# Altium schematic sheet 202011AWSNP03.SchDoc
size A4
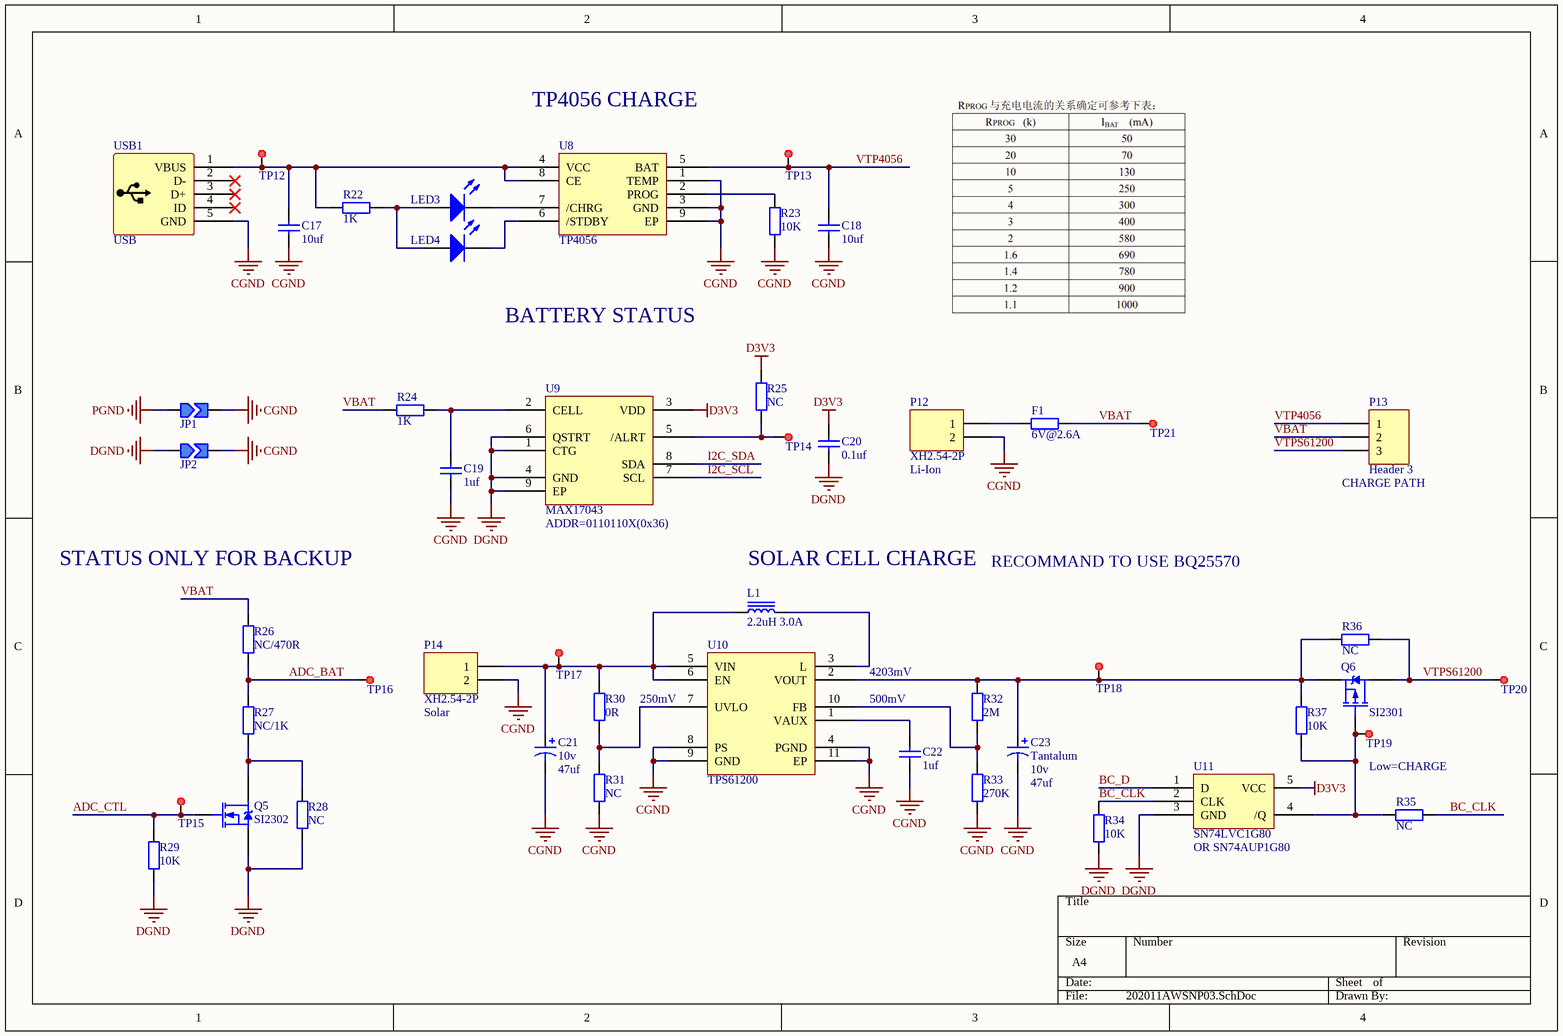
[diagram p0: 202011AWSNP03.SchDoc]

## Parts
C17  value 10uf  [C0805]  (hidden comment: Cap)
C18  value 10uf  [C0805]  (hidden comment: Cap)
C19  value 1uf  [C0805]  (hidden comment: Cap)
C20  value 0.1uf  [C0805]  (hidden comment: Cap)
C21  value 47uf  voltage: 10v  [C4X5.4-SMD]  (hidden comment: Cap2)
C22  value 1uf  [C0805]  (hidden comment: Cap)
C23  Tantalum  value 47uf  voltage: 10v  [C1210T-3528B]
F1  value 6V@2.6A  [F1812]  (hidden comment: Fuse)
JP1  Jumper  [Jumper-2]  (value not drawn)
JP2  Jumper  [Jumper-2]  (value not drawn)
L1  value 2.2uH 3.0A  [L04042]  (hidden comment: Inductor Iron)
LED3  LED  [LED1206]  (value not drawn)
LED4  LED  [LED1206]  (value not drawn)
P12  XH2.54-2P  [XH2.54-2P]
P13  Header 3  [HDR1X3]
P14  XH2.54-2P  [XH2.54-2P]
Q5  SI2302  [SI2302-SOT23]
Q6  SI2301  [SI2301-SOT23]
R22  value 1K  [R0805]  (hidden comment: Res)
R23  value 10K  [R0805]  (hidden comment: Res)
R24  value 1K  [R0805]  (hidden comment: Res)
R25  value NC  [R0805]  (hidden comment: Res)
R26  value NC/470R  [R0805]  (hidden comment: Res)
R27  value NC/1K  [R0805]  (hidden comment: Res)
R28  value NC  [R0805]  (hidden comment: Res)
R29  value 10K  [R0805]  (hidden comment: Res)
R30  value 0R  [R0805]  (hidden comment: Res)
R31  value NC  [R0805]  (hidden comment: Res)
R32  value 2M  [R0805]  (hidden comment: Res)
R33  value 270K  [R0805]  (hidden comment: Res)
R34  value 10K  [R0805]  (hidden comment: Res)
R35  value NC  [R0805]  (hidden comment: Res)
R36  value NC  [R0805]  (hidden comment: Res)
R37  value 10K  [R0805]  (hidden comment: Res)
TP12  TestPoint  [TestPoint-R30]  (value not drawn)
TP13  TestPoint  [TestPoint-R30]  (value not drawn)
TP14  TestPoint  [TestPoint-R30]  (value not drawn)
TP15  TestPoint  [TestPoint-R30]  (value not drawn)
TP16  TestPoint  [TestPoint-R30]  (value not drawn)
TP17  TestPoint  [TestPoint-R30]  (value not drawn)
TP18  TestPoint  [TestPoint-R30]  (value not drawn)
TP19  TestPoint  [TestPoint-R30]  (value not drawn)
TP20  TestPoint  [TestPoint-R30]  (value not drawn)
TP21  TestPoint  [TestPoint-R30]  (value not drawn)
U8  TP4056  [TP4056-SOIC8]
U9  MAX17043  [MAX17043-TDFN8]
U10  TPS61200  [TPS61200-VSON10]
U11  SN74LVC1G80  [SN74LVC1G80-SC70]
USB1  USB  [USB-Mini-SMT]

## Nets
CGND: C17.1 C18.1 C19.1 C21.2 C22.1 C23.2 JP1.2 JP2.2 P12.2 P14.2 R23.2 R31.2 R33.2 U8.1(TEMP) U8.3(GND) U8.9(EP) U10.4(PGND) U10.8(PS) U10.9(GND) U10.11(EP) USB1.5(GND)
D3V3: C20.2 R25.1 U9.3(VDD) U11.5(VCC)
DGND: C20.1 JP2.1 Q5.2(S) R28.1 R29.1 R34.2 U9.1(CTG) U9.4(GND) U9.6(QSTRT) U9.9(EP) U11.3(GND)
PGND: JP1.1
ADC_BAT: R26.1 R27.2 TP16.1
ADC_CTL: Q5.1(G) R29.2 TP15.1
BC_CLK: R34.1 R35.1 U11.2(CLK)
BC_D: U11.1(D)
I2C_SCL: U9.7(SCL)
I2C_SDA: U9.8(SDA)
VBAT: F1.2 P13.2 R24.2 R26.2 TP21.1
VTP4056: C18.2 P13.1 TP13.1 U8.5(BAT)
VTPS61200: P13.3 Q6.3(D) R36.1 TP20.1
NetC17_2: C17.2 R22.2 TP12.1 U8.4(VCC) U8.8(CE) USB1.1(VBUS)
NetC19_2: C19.2 R24.1 U9.2(CELL)
NetC21_1: C21.1 L1.1 P14.1 R30.1 TP17.1 U10.5(VIN) U10.6(EN)
NetC22_2: C22.2 U10.1(VAUX)
NetC23_1: C23.1 Q6.2(S) R32.1 R36.2 R37.1 TP18.1 U10.2(VOUT)
NetF1_1: F1.1 P12.1
NetL1_2: L1.2 U10.3(L)
NetLED3_1: LED3.1(A) LED4.1(A) R22.1
NetLED3_2: LED3.2(K) U8.7(/CHRG)
NetLED4_2: LED4.2(K) U8.6(/STDBY)
NetQ5_3: Q5.3(D) R27.1 R28.2
NetQ6_1: Q6.1(G) R35.2 R37.2 TP19.1 U11.4(/Q)
NetR23_1: R23.1 U8.2(PROG)
NetR25_2: R25.2 TP14.1 U9.5(/ALRT)
NetR30_2: R30.2 R31.1 U10.7(UVLO)
NetR32_2: R32.2 R33.1 U10.10(FB)

Not connected (* = marked no-connect by the designer): USB1 2(D-)* 3(D+)* 4(ID)*

## Notes on the sheet
- TP4056 CHARGE
- BATTERY STATUS
- (near P12) Li-Ion
- (near P13) CHARGE PATH
- STATUS ONLY FOR BACKUP
- (near U9) ADDR=0110110X(0x36)
- (near L1) SOLAR CELL CHARGE
- RECOMMAND TO USE BQ25570
- (near P14) Solar
- 250mV
- 500mV
- 4203mV
- Low=CHARGE
- (near U11) OR SN74AUP1G80

## Library data of the parts
C23 = Cap-Tantalum
L1 = Inductor Iron: Magnetic-Core Inductor
P13 = Header 3: Header, 3-Pin; LatestRevisionDate: 17-Jul-2002; LatestRevisionNote: Re-released for DXP Platform.; Publisher: Altium Limited
Q5 = SI2302: N-Channel 20 V (D-S) MOSFET
Q6 = SI2301: P-Channel 20 V (D-S) MOSFET
R22-R37 = Res: 电阻
TP12-TP21 = TestPoint: 测试点
U8 = TP4056: 1A 线性锂离子电池充电器
U9 = MAX17043: 1-Cell/2-Cell Fuel Gauge with ModelGauge and Low-Battery Alert
U10 = TPS61200: TPS61200x Low Input Voltage Synchronous Boost Converter With 1.3-A Switches
U11 = SN74LVC1G80: Single Positive-Edge-Triggered D-Type Flip-Flop